# EAGLE design Tugas Despro NEW (EAGLE 9.6.2)
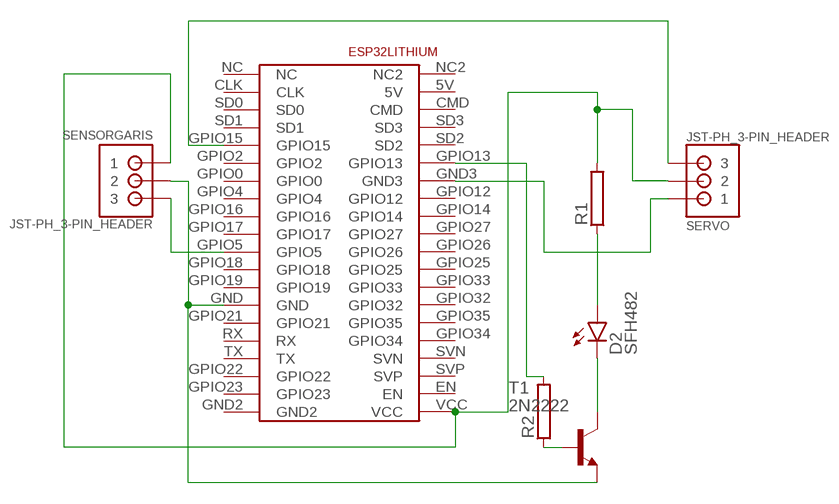
[diagram p0: schematic, sheet 1]

## Parts
D2  SFH482  [SFH482]
R1  RAC01  [AC01]
R2  RAC01  [AC01]
SENSORGARIS  JST-PH_3-PIN_HEADER  [JST_B3B-PH_HEADER]
SERVO  JST-PH_3-PIN_HEADER  [JST_B3B-PH_HEADER]
T1  2N2222  [TO18]
U$5  ESP32LITHIUM  [ESP32LITHIUM]

## Nets
N$1: SENSORGARIS.P3 U$5.GPIO5
N$2: SENSORGARIS.P2 T1.1(E) U$5.GND
N$3: SERVO.P3 U$5.GPIO15
N$4: R2.2 U$5.GPIO13
N$5: R1.2 SERVO.P2
N$6: D2.A R1.1
N$7: SENSORGARIS.P1 U$5.VCC
N$8: D2.K(C) T1.3(C)
N$12: R2.1 T1.2(B)
N$18: SERVO.P1 U$5.GND3
Unconnected: U$5.5V U$5.CLK U$5.CMD U$5.EN U$5.GND2 U$5.GPIO0 U$5.GPIO2 U$5.GPIO4 U$5.GPIO12 U$5.GPIO14 U$5.GPIO16 U$5.GPIO17 U$5.GPIO18 U$5.GPIO19 U$5.GPIO21 U$5.GPIO22 U$5.GPIO23 U$5.GPIO25 U$5.GPIO26 U$5.GPIO27 U$5.GPIO32 U$5.GPIO33 U$5.GPIO34 U$5.GPIO35 U$5.NC U$5.NC2 U$5.RX U$5.SD0 U$5.SD1 U$5.SD2 U$5.SD3 U$5.SVN U$5.SVP U$5.TX

## Library data of the parts
D2 = led:SFH482: IR LED infrared emitting diode, Infineon
R1 R2 = resistor-power:R: Power Resitor; OC_FARNELL: unknown; OC_NEWARK: unknown
SENSORGARIS SERVO = srg:JST-PH_3-PIN_HEADER: 3-pin JST PH Shrouded Header, top entry P/N B3B-PH-K-S Mating connector PHR-3
T1 = transistor:2N2222: NPN TRANSISTOR
U$5 = ESP32LITHIUM:ESP32LITHIUM

## Board
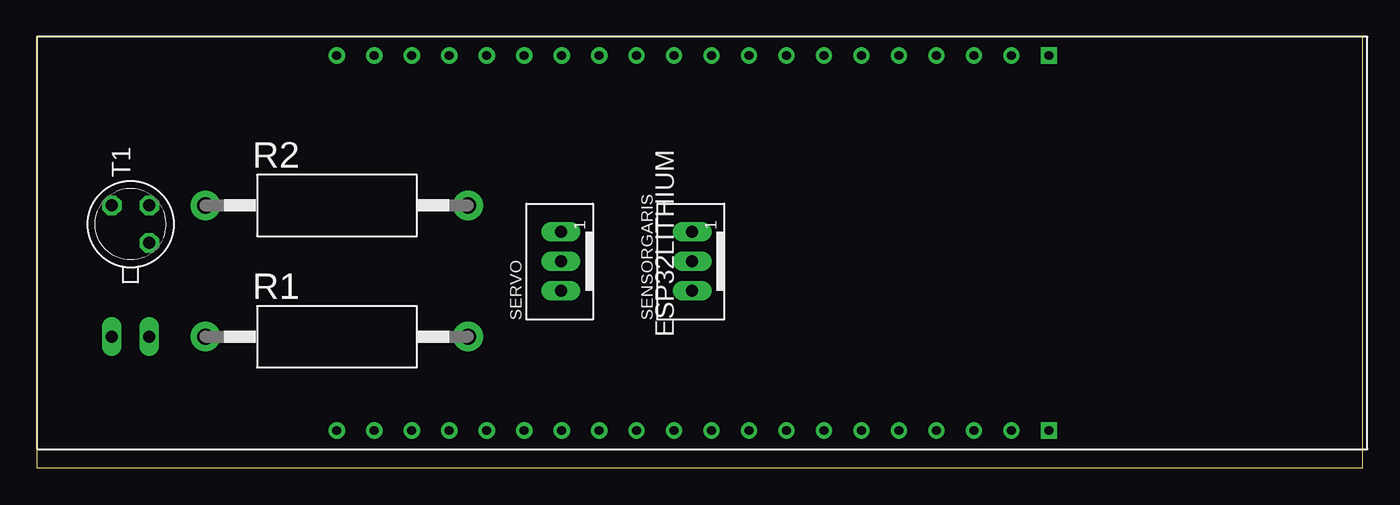
[diagram p1: board, top side]
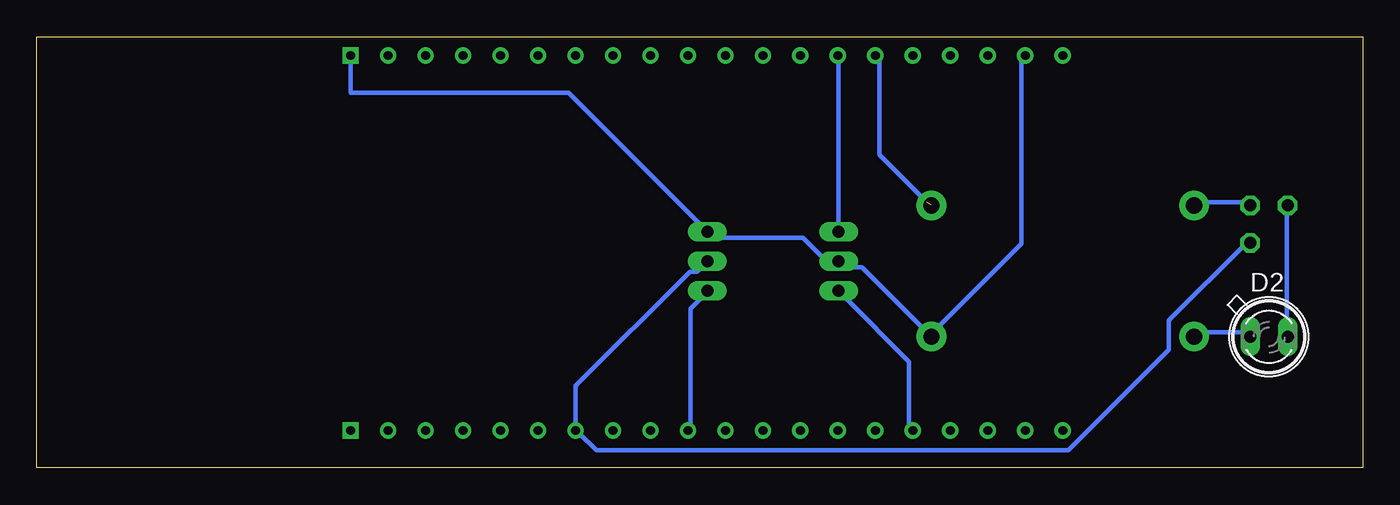
[diagram p2: board, bottom side, seen from below]

Size 89.84 x 29.2 mm. Coordinates in mm from the lower left corner, seen from the top.
Outline: 0,0 89.84,0 89.84,29.2 0,29.2 0,0
Copper layers (1*16): Top 0.035mm / dielectric 1.5mm / Bottom 0.035mm
Design rules "default *": minimum track width 0.3mm, minimum drill 0.6mm, track to track 0.5mm, track to pad 0.5mm, pad to pad 0.5mm, via to via 0.5mm, smd to smd 6mil, copper to edge 0.5mm, drill to drill 0.5mm, minimum pad ring 10mil, minimum via ring 8mil, stop-mask expansion 4mil, vias tented up to drill 0mil, thermal gap 10mil

### Footprints (pad centres in the part's own frame; a part is rotated, then mirrored left to right if it is on the bottom)
SFH482 = drill 0.813 long: A -1.27,0; K 1.27,0
AC01 = drill 1.1 pad 2: 1 -8.9,0; 2 8.9,0
JST_B3B-PH_HEADER = drill 0.8 long: P1 2.027,0.048; P2 0.028,0.048; P3 -1.972,0.048
TO18 = drill 0.813 octagon: 1 -1.27,-1.27; 2 1.27,-1.27; 3 1.27,1.27
ESP32LITHIUM = drill 0.6: 5V 25.4,-2.54; CLK 0,-2.54; CMD 25.4,-5.08; EN 25.4,-45.72; GND 0,-33.02; GND3 25.4,-15.24; GPIO0 0,-15.24; GPIO2 0,-12.7; GPIO4 0,-17.78; GPIO5 0,-25.4; GPIO12 25.4,-17.78; GPIO13 25.4,-12.7; GPIO14 25.4,-20.32; GPIO15 0,-10.16; GPIO16 0,-20.32; GPIO17 0,-22.86; GPIO18 0,-27.94; GPIO19 0,-30.48; GPIO21 0,-35.56; GPIO22 0,-43.18; GPIO23 0,-45.72; GPIO25 25.4,-27.94; GPIO26 25.4,-25.4; GPIO27 25.4,-22.86; GPIO32 25.4,-33.02; GPIO33 25.4,-30.48; GPIO34 25.4,-38.1; GPIO35 25.4,-35.56; NC 0,0; NC2 25.4,0; RX 0,-38.1; SD0 0,-5.08; SD1 0,-7.62; SD2 25.4,-10.16; SD3 25.4,-7.62; SVN 25.4,-40.64; SVP 25.4,-43.18; TX 0,-40.64 | drill 0.6 square: GND2 0,-48.26; VCC 25.4,-48.26

### Placement (x,y rotation side)
D2  6.35,8.89 0 bottom
R1  20.32,8.89 0 top
R2  20.32,17.78 0 top
SENSORGARIS  44.45,13.97 90 top
SERVO  35.56,13.97 90 top
T1  6.35,16.51 90 top
U$5  20.32,2.54 90 top

### Tracks (layer width: path | path; a pad name or v marks a point on that pad's centre or on a via)
N$1
  Bottom 0.3: U$5.GPIO5 45.53,2.8 45.53,10.8 44.73,11.6 SENSORGARIS.P3
N$2
  Bottom 0.3: T1.1 7.93,15.2 13.13,10 13.13,8 19.93,1.2 51.93,1.2 53.13,2.4 U$5.GND 53.34,5.56 45.6,13.3 45.1,13.3 SENSORGARIS.P2
N$3
  Bottom 0.3: U$5.GPIO15 30.73,2.8 30.73,7.2 35.13,11.6 SERVO.P3
N$4  (1 unrouted)
  Bottom 0.3: 29.53,18 32.73,21.2 32.73,27.6 U$5.GPIO13
N$5
  Bottom 0.3: 23.13,27.6 23.13,15.2 29.13,9.2 R1.2 33.93,13.6 35.13,13.6 SERVO.P2 35.53,14 36.33,14 37.93,15.6 44.33,15.6
N$6
  Bottom 0.3: D2.A 7.93,9.2 11.13,9.2 R1.1
N$7
  Bottom 0.3: SENSORGARIS.P1 53.8,25.4 68.58,25.4 U$5.VCC
N$8
  Bottom 0.3: D2.K 5.13,9.2 5.13,17.6 T1.3
N$12
  Bottom 0.3: T1.2 7.93,18 11.13,18 R2.1
N$18
  Bottom 0.3: U$5.GND3 35.53,27.6 35.53,16 SERVO.P1